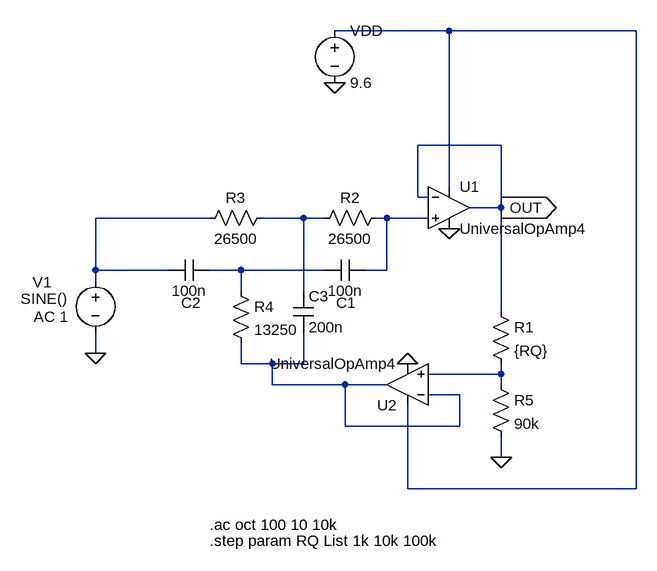
[diagram p0: schematic NOTCH-60HZ.asc]
NOTCH-60HZ.asc, the LTspice schematic file:
Version 4
SHEET 1 880 680
WIRE 144 -160 -32 -160
WIRE 432 -160 144 -160
WIRE 224 16 96 16
WIRE 144 80 144 -160
WIRE 96 96 96 16
WIRE 112 96 96 96
WIRE 224 112 224 16
WIRE 224 112 176 112
WIRE -224 128 -400 128
WIRE -80 128 -144 128
WIRE -48 128 -80 128
WIRE 48 128 32 128
WIRE 112 128 48 128
WIRE -400 208 -400 128
WIRE -288 208 -400 208
WIRE -176 208 -224 208
WIRE -48 208 -176 208
WIRE 48 208 48 128
WIRE 48 208 16 208
WIRE -400 224 -400 208
WIRE -176 240 -176 208
WIRE -80 240 -80 128
WIRE 224 272 224 112
WIRE -400 336 -400 304
WIRE -176 352 -176 320
WIRE -128 352 -176 352
WIRE -80 352 -80 304
WIRE -80 352 -128 352
WIRE 224 368 224 352
WIRE 224 368 112 368
WIRE -128 384 -128 352
WIRE -16 384 -128 384
WIRE 48 384 -16 384
WIRE 224 384 224 368
WIRE 160 400 112 400
WIRE -16 448 -16 384
WIRE 160 448 160 400
WIRE 160 448 -16 448
WIRE 224 496 224 464
WIRE 80 544 80 416
WIRE 432 544 432 -160
WIRE 432 544 80 544
FLAG -32 -80 0
FLAG -400 336 0
FLAG 224 112 OUT
IOPIN 224 112 Out
FLAG 224 496 0
FLAG 80 352 0
FLAG 144 144 0
SYMBOL OpAmps\\UniversalOpAmp4 144 112 R0
SYMATTR InstName U1
SYMBOL voltage -32 -176 R0
WINDOW 123 0 0 Left 0
WINDOW 39 0 0 Left 0
SYMATTR InstName VDD
SYMATTR Value 9.6
SYMBOL voltage -400 208 R0
WINDOW 0 -97 19 Left 2
WINDOW 3 -115 44 Left 2
WINDOW 123 -95 72 Left 2
WINDOW 39 0 0 Left 0
SYMATTR InstName V1
SYMATTR Value SINE()
SYMATTR Value2 AC 1
SYMBOL res 48 112 R90
WINDOW 0 0 56 VBottom 2
WINDOW 3 32 56 VTop 2
SYMATTR InstName R2
SYMATTR Value 26500
SYMBOL res -128 112 R90
WINDOW 0 0 56 VBottom 2
WINDOW 3 32 56 VTop 2
SYMATTR InstName R3
SYMATTR Value 26500
SYMBOL cap 16 192 R90
WINDOW 0 82 30 VBottom 2
WINDOW 3 32 32 VTop 2
SYMATTR InstName C1
SYMATTR Value 100n
SYMBOL cap -224 192 R90
WINDOW 0 82 29 VBottom 2
WINDOW 3 32 32 VTop 2
SYMATTR InstName C2
SYMATTR Value 100n
SYMBOL cap -96 240 R0
SYMATTR InstName C3
SYMATTR Value 200n
SYMBOL res -192 224 R0
SYMATTR InstName R4
SYMATTR Value 13250
SYMBOL res 208 256 R0
SYMATTR InstName R1
SYMATTR Value {RQ}
SYMBOL res 208 368 R0
SYMATTR InstName R5
SYMATTR Value 90k
SYMBOL OpAmps\\UniversalOpAmp4 80 384 R180
SYMATTR InstName U2
TEXT -224 600 Left 2 !.ac oct 100 10 10k
TEXT -224 624 Left 2 !.step param RQ List 1k 10k 100k

The netlist it stands for:
* NOTCH-60HZ.asc
* U1: UniversalOpAmp4 (symbol OpAmps\UniversalOpAmp4 not available, pins judged from their places): In+=N004 In-=OUT V+=N001 V-=0 OUT=OUT
VDD N001 0 9.6
V1 N002 0 SINE() AC 1
R2 N004 N003 26500
R3 N003 N002 26500
C1 N004 N005 100n
C2 N005 N002 100n
C3 N003 N006 200n
R4 N005 N006 13250
R1 OUT N007 {RQ}
R5 N007 0 90k
* U2: UniversalOpAmp4 (symbol OpAmps\UniversalOpAmp4 not available, pins judged from their places): In+=N007 In-=N006 V+=N001 V-=0 OUT=N006
.ac oct 100 10 10k
.step param RQ List 1k 10k 100k
.backanno
.end